# Altium schematic sheet LEDdriver-LM3409.SchDoc
size A4
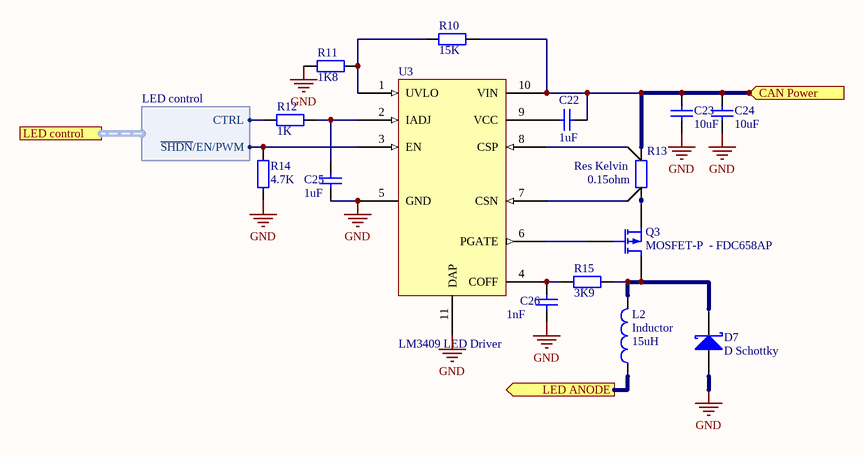
[diagram p0: LEDdriver-LM3409.SchDoc]

## Parts
C22  value 1uF  [C0603]  (hidden comment: Cap)
C23  value 10uF  [Capacitor 1210 (3225) package]  (hidden comment: Cap)
C24  value 10uF  [Capacitor 1210 (3225) package]  (hidden comment: Cap)
C25  value 1uF  [C0603]  (hidden comment: Cap)
C26  value 1nF  [C0603]  (hidden comment: Cap)
D7  D Schottky  [Schottky rectifier]
L2  Inductor  value 15uH  [Inductor 3131]
Q3  MOSFET-P  - FDC658AP  [SuperSOT6 - FDC658AP]
R10  value 15K  [R0603]  (hidden comment: Res)
R11  value 1K8  [R0603]  (hidden comment: Res)
R12  value 1K  [R0603]  (hidden comment: Res)
R13  Res Kelvin  value 0.15ohm  [2512 package + Kelvin Cons - ERJ1TR Rsns]  (net tie)
R14  value 4.7K  [R0603]  (hidden comment: Res)
R15  value 3K9  [R0603]  (hidden comment: Res)
U3  LM3409 LED Driver  [10eMSOP + thermal pad - LM3409]

## Ports
CAN Power (in), LED ANODE (out), LED control (harness LED control)

## Harnesses
LED control: CTRL, ~{SHDN}/EN/PWM

## Nets
GND: C23.2 C24.2 C25.2 C26.2 D7.1(A) R11.2 R14.1 U3.5(GND) U3.11(DAP)
CAN Power: C22.1 C23.1 C24.1 R10.1 R13.2 U3.10(VIN) ; port CAN Power
LED ANODE: L2.1 ; port LED ANODE
NetC22_2: C22.2 U3.9(VCC)
NetC25_1: C25.1 R12.1 U3.2(IADJ)
NetC26_1: C26.1 R15.2 U3.4(COFF)
NetD7_2: D7.2(K) L2.2 Q3.1(D) R15.1
NetQ3_2: Q3.2(G) U3.6(PGATE)
NetQ3_3: Q3.3(S) R13.1
NetR10_2: R10.2 R11.1 U3.1(UVLO)
NetR12_2: R12.2 ; port LED control.CTRL
NetR13_3: R13.3 U3.7(CSN)
NetR13_4: R13.4 U3.8(CSP)
NetR14_2: R14.2 U3.3(EN) ; port LED control.~{SHDN}/EN/PWM

## Library data of the parts
C22-C26 = Cap: Capacitor; Published: 8-Jun-2000; LatestRevisionDate: 17-Jul-2002; LatestRevisionNote: Re-released for DXP Platform.; PackageReference: RAD-0.3; Publisher: Altium Limited
  C22 C25: farnell: 1907508 £0.22
  C23 C24: farnell: 1735537 £2.18
  C26: farnell: 1759088
D7 = D Schottky: Schottky Diode; Published: 8-Jun-2000; LatestRevisionDate: 17-Jul-2002; LatestRevisionNote: Re-released for DXP Platform.; PackageReference: SMB; Publisher: Altium Limited; Code_JEDEC: DO-214-AA; farnell: 1467550 £0.21
L2 = Inductor: Code_IEC: 1005; Published: 8-Jun-2000; LatestRevisionDate: 29-May-2009; LatestRevisionNote: IPC-7351 Footprint Added.; PackageReference: 0402-A; Publisher: Altium Limited; PackageDescription: Chip Inductor; Code_JEITA: 0402; Farnell: 1782825 £0.33
Q3 = MOSFET-P: P-Channel MOSFET; Published: 8-Jun-2000; LatestRevisionDate: 17-Jul-2002; LatestRevisionNote: Re-released for DXP Platform.; PackageVersion: 1995/1996; PackageReference: E3; Publisher: Altium Limited; Farnell: 1495228 £0.68
R10-R12 R14 R15 = Res2: Resistor
  R10: farnell: 9330615
  R11: farnell: 9330712
  R12: farnell: 9330380
  R14: farnell: 9331247
  R15: farnell: 9331140
R13 = Res Kelvin: Resistor Kelvin; Published: 8-Jun-2000; LatestRevisionDate: 17-Jul-2002; LatestRevisionNote: Re-released for DXP Platform.; PackageReference: AXIAL-0.4; Publisher: Altium Limited
U3 = LM3409: PFET Buck Controller for High Power LED Drivers; Farnell: 1778582 £2.77